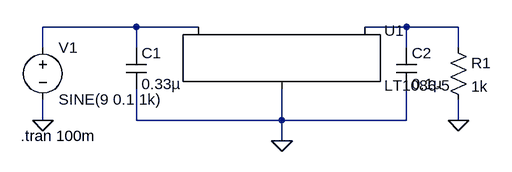
[diagram p0: schematic voltage_regulator.asc]
voltage_regulator.asc, the LTspice schematic file:
Version 4
SHEET 1 880 680
WIRE -208 -48 -352 -48
WIRE -112 -48 -208 -48
WIRE 208 -48 144 -48
WIRE 288 -48 208 -48
WIRE -352 -16 -352 -48
WIRE -208 -16 -208 -48
WIRE 208 -16 208 -48
WIRE 288 -16 288 -48
WIRE -352 96 -352 64
WIRE -208 96 -208 48
WIRE 16 96 16 48
WIRE 16 96 -208 96
WIRE 208 96 208 48
WIRE 208 96 16 96
WIRE 288 96 288 64
WIRE 16 128 16 96
FLAG -352 96 0
FLAG 288 96 0
FLAG 16 128 0
SYMBOL PowerProducts\\LT1086-5 16 -48 R0
SYMATTR InstName U1
SYMBOL voltage -352 -32 R0
WINDOW 123 0 0 Left 0
WINDOW 39 0 0 Left 0
SYMATTR InstName V1
SYMATTR Value SINE(9 0.1 1k)
SYMBOL cap -224 -16 R0
SYMATTR InstName C1
SYMATTR Value 0.33µ
SYMBOL cap 192 -16 R0
SYMATTR InstName C2
SYMATTR Value 0.1µ
SYMBOL res 272 -32 R0
SYMATTR InstName R1
SYMATTR Value 1k
TEXT -386 120 Left 2 !.tran 100m

The netlist it stands for:
* voltage_regulator.asc
XU1 0 N002 N001 LT1086-5
V1 N001 0 SINE(9 0.1 1k)
C1 N001 0 0.33µ
C2 N002 0 0.1µ
R1 N002 0 1k
.tran 100m
.backanno
.end